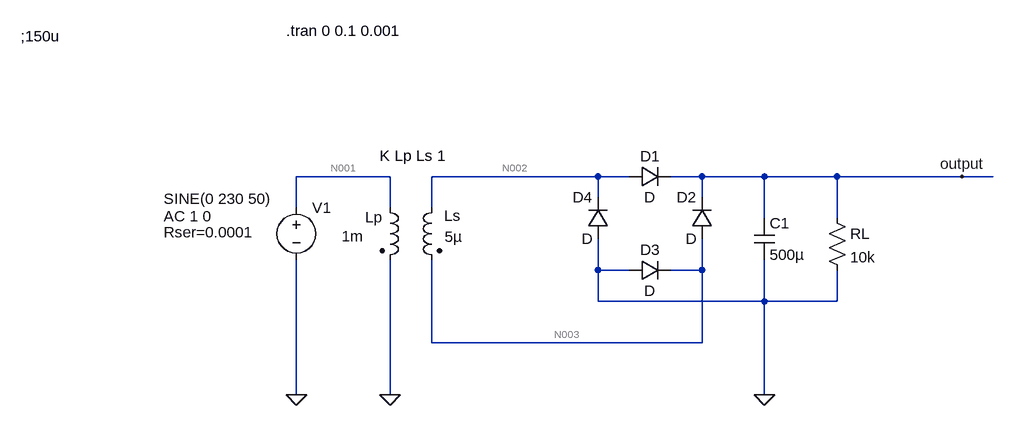
[diagram p0: schematic sim_carte_alim.asc]
sim_carte_alim.asc, the LTspice schematic file:
Version 4
SHEET 1 1124 680
WIRE 0 32 -144 32
WIRE 320 32 64 32
WIRE 368 32 320 32
WIRE 480 32 432 32
WIRE 576 32 480 32
WIRE 688 32 576 32
WIRE 880 32 688 32
WIRE 928 32 880 32
WIRE 320 64 320 32
WIRE 480 64 480 32
WIRE -144 80 -144 32
WIRE 0 80 0 32
WIRE 64 80 64 32
WIRE 576 96 576 32
WIRE 688 96 688 32
WIRE 320 176 320 128
WIRE 368 176 320 176
WIRE 480 176 480 128
WIRE 480 176 432 176
WIRE 320 224 320 176
WIRE 576 224 576 160
WIRE 576 224 320 224
WIRE 688 224 688 176
WIRE 688 224 576 224
WIRE 64 288 64 160
WIRE 480 288 480 176
WIRE 480 288 64 288
WIRE -144 368 -144 160
WIRE 0 368 0 160
WIRE 576 368 576 224
FLAG -144 368 0
FLAG 0 368 0
FLAG 880 32 output
FLAG 576 368 0
SYMBOL ind2 -16 64 R0
WINDOW 0 -22 31 Left 2
WINDOW 3 -58 60 Left 2
SYMATTR InstName Lp
SYMATTR Value 1m
SYMATTR Type ind
SYMBOL ind2 80 64 M0
WINDOW 0 -29 28 Left 2
WINDOW 3 -31 61 Left 2
SYMATTR InstName Ls
SYMATTR Value 5µ
SYMATTR Type ind
SYMBOL voltage -144 64 R0
WINDOW 3 -204 2 Left 2
WINDOW 123 -204 29 Left 2
WINDOW 39 -204 54 Left 2
SYMATTR Value SINE(0 230 50)
SYMATTR Value2 AC 1 0
SYMATTR SpiceLine Rser=0.0001
SYMATTR InstName V1
SYMBOL diode 368 48 R270
WINDOW 0 32 32 VTop 2
WINDOW 3 0 32 VBottom 2
SYMATTR InstName D1
SYMBOL diode 496 128 R180
WINDOW 0 24 64 Left 2
WINDOW 3 24 0 Left 2
SYMATTR InstName D2
SYMBOL diode 368 192 R270
WINDOW 0 32 32 VTop 2
WINDOW 3 0 32 VBottom 2
SYMATTR InstName D3
SYMBOL diode 336 128 R180
WINDOW 0 24 64 Left 2
WINDOW 3 24 0 Left 2
SYMATTR InstName D4
SYMBOL cap 560 96 R0
SYMATTR InstName C1
SYMATTR Value 500µ
SYMBOL res 672 80 R0
SYMATTR InstName RL
SYMATTR Value 10k
TEXT -16 0 Left 2 !K Lp Ls 1
TEXT -160 -192 Left 2 !.tran 0 0.1 0.001
TEXT -568 -184 Left 2 !;150u

The netlist it stands for:
* sim_carte_alim.asc
Lp N001 0 1m
Ls N002 N003 5µ
V1 N001 0 SINE(0 230 50) AC 1 0 Rser=0.0001
D1 N002 output D
D2 N003 output D
D3 0 N003 D
D4 0 N002 D
C1 output 0 500µ
RL output 0 10k
.model D D
.lib standard.dio
K Lp Ls 1
.tran 0 0.1 0.001
;150u
.backanno
.end

* Results of the author's LTspice run, read from the files saved beside the schematic
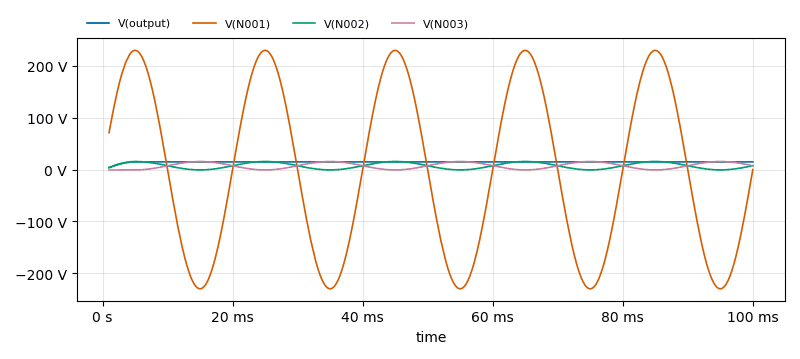
[diagram p1: Transient Analysis of sim_carte_alim.asc, plotted from the saved traces]
* Transient Analysis, 1 run:
*   V(output): min 3.312 V, max 14.79 V, average 14.6 V, rms 14.63 V, last 14.77 V
*   V(N001): min -230.1 V, max 229.9 V, average -427.3 mV, rms 163.5 V, last 728 µV
*   V(N002): min -761.2 mV, max 15.51 V, average 7.283 V, rms 9.27 V, last 7.387 V
*   V(N003): min -856.8 mV, max 15.52 V, average 7.313 V, rms 9.379 V, last 7.387 V